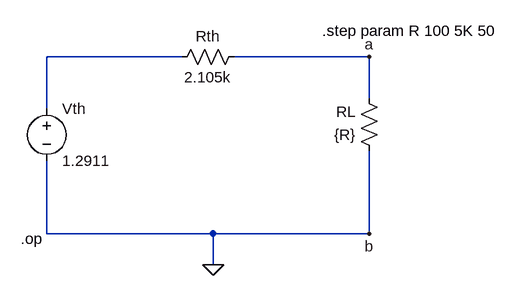
[diagram p0: schematic OELSim1102_00725205131037_h.asc]
OELSim1102_00725205131037_h.asc, the LTspice schematic file:
Version 4.1
SHEET 1 880 680
WIRE 272 48 64 48
WIRE 560 48 352 48
WIRE 560 112 560 48
WIRE 64 128 64 48
WIRE 64 320 64 208
WIRE 320 320 64 320
WIRE 560 320 560 192
WIRE 560 320 320 320
WIRE 320 368 320 320
FLAG 560 48 a
FLAG 560 320 b
FLAG 320 368 0
SYMBOL voltage 64 112 R0
WINDOW 123 0 0 Left 0
WINDOW 39 0 0 Left 0
SYMATTR InstName Vth
SYMATTR Value 1.2911
SYMBOL res 368 32 R90
WINDOW 0 0 56 VBottom 2
WINDOW 3 32 56 VTop 2
SYMATTR InstName Rth
SYMATTR Value 2.105k
SYMBOL res 576 208 R180
WINDOW 0 36 76 Left 2
WINDOW 3 36 40 Left 2
SYMATTR InstName RL
SYMATTR Value {R}
TEXT 488 8 Left 2 !.step param R 100 5K 50
TEXT 24 328 Left 2 !.op

The netlist it stands for:
* OELSim1102_00725205131037_h.asc
Vth N001 0 1.2911
Rth a N001 2.105k
RL 0 a {R}
.step param R 100 5K 50
.op
.backanno
.end

* Results of the author's LTspice run, read from the files saved beside the schematic
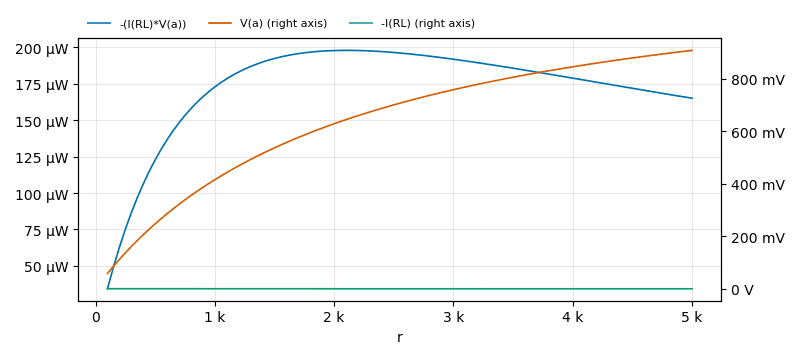
[diagram p1: Operating Point of OELSim1102_00725205131037_h.asc, plotted from the saved traces]
* Operating Point, 1 run:
*   -(I(RL)*V(a)): 34.28 µW at r=100 , 165.1 µW at r=5 k, min 34.28 µW, max 198 µW
*   V(a): 58.55 mV at r=100 , 908.6 mV at r=5 k, min 58.55 mV, max 908.6 mV
*   -I(RL): 585.5 µA at r=100 , 181.7 µA at r=5 k, min 181.7 µA, max 585.5 µA